# EasyEDA schematic ERA battery.json
TITLE: Sheet_1; REV: 1.0; Date: 2021-11-12; Sheet: 1/1; Company: Your Company
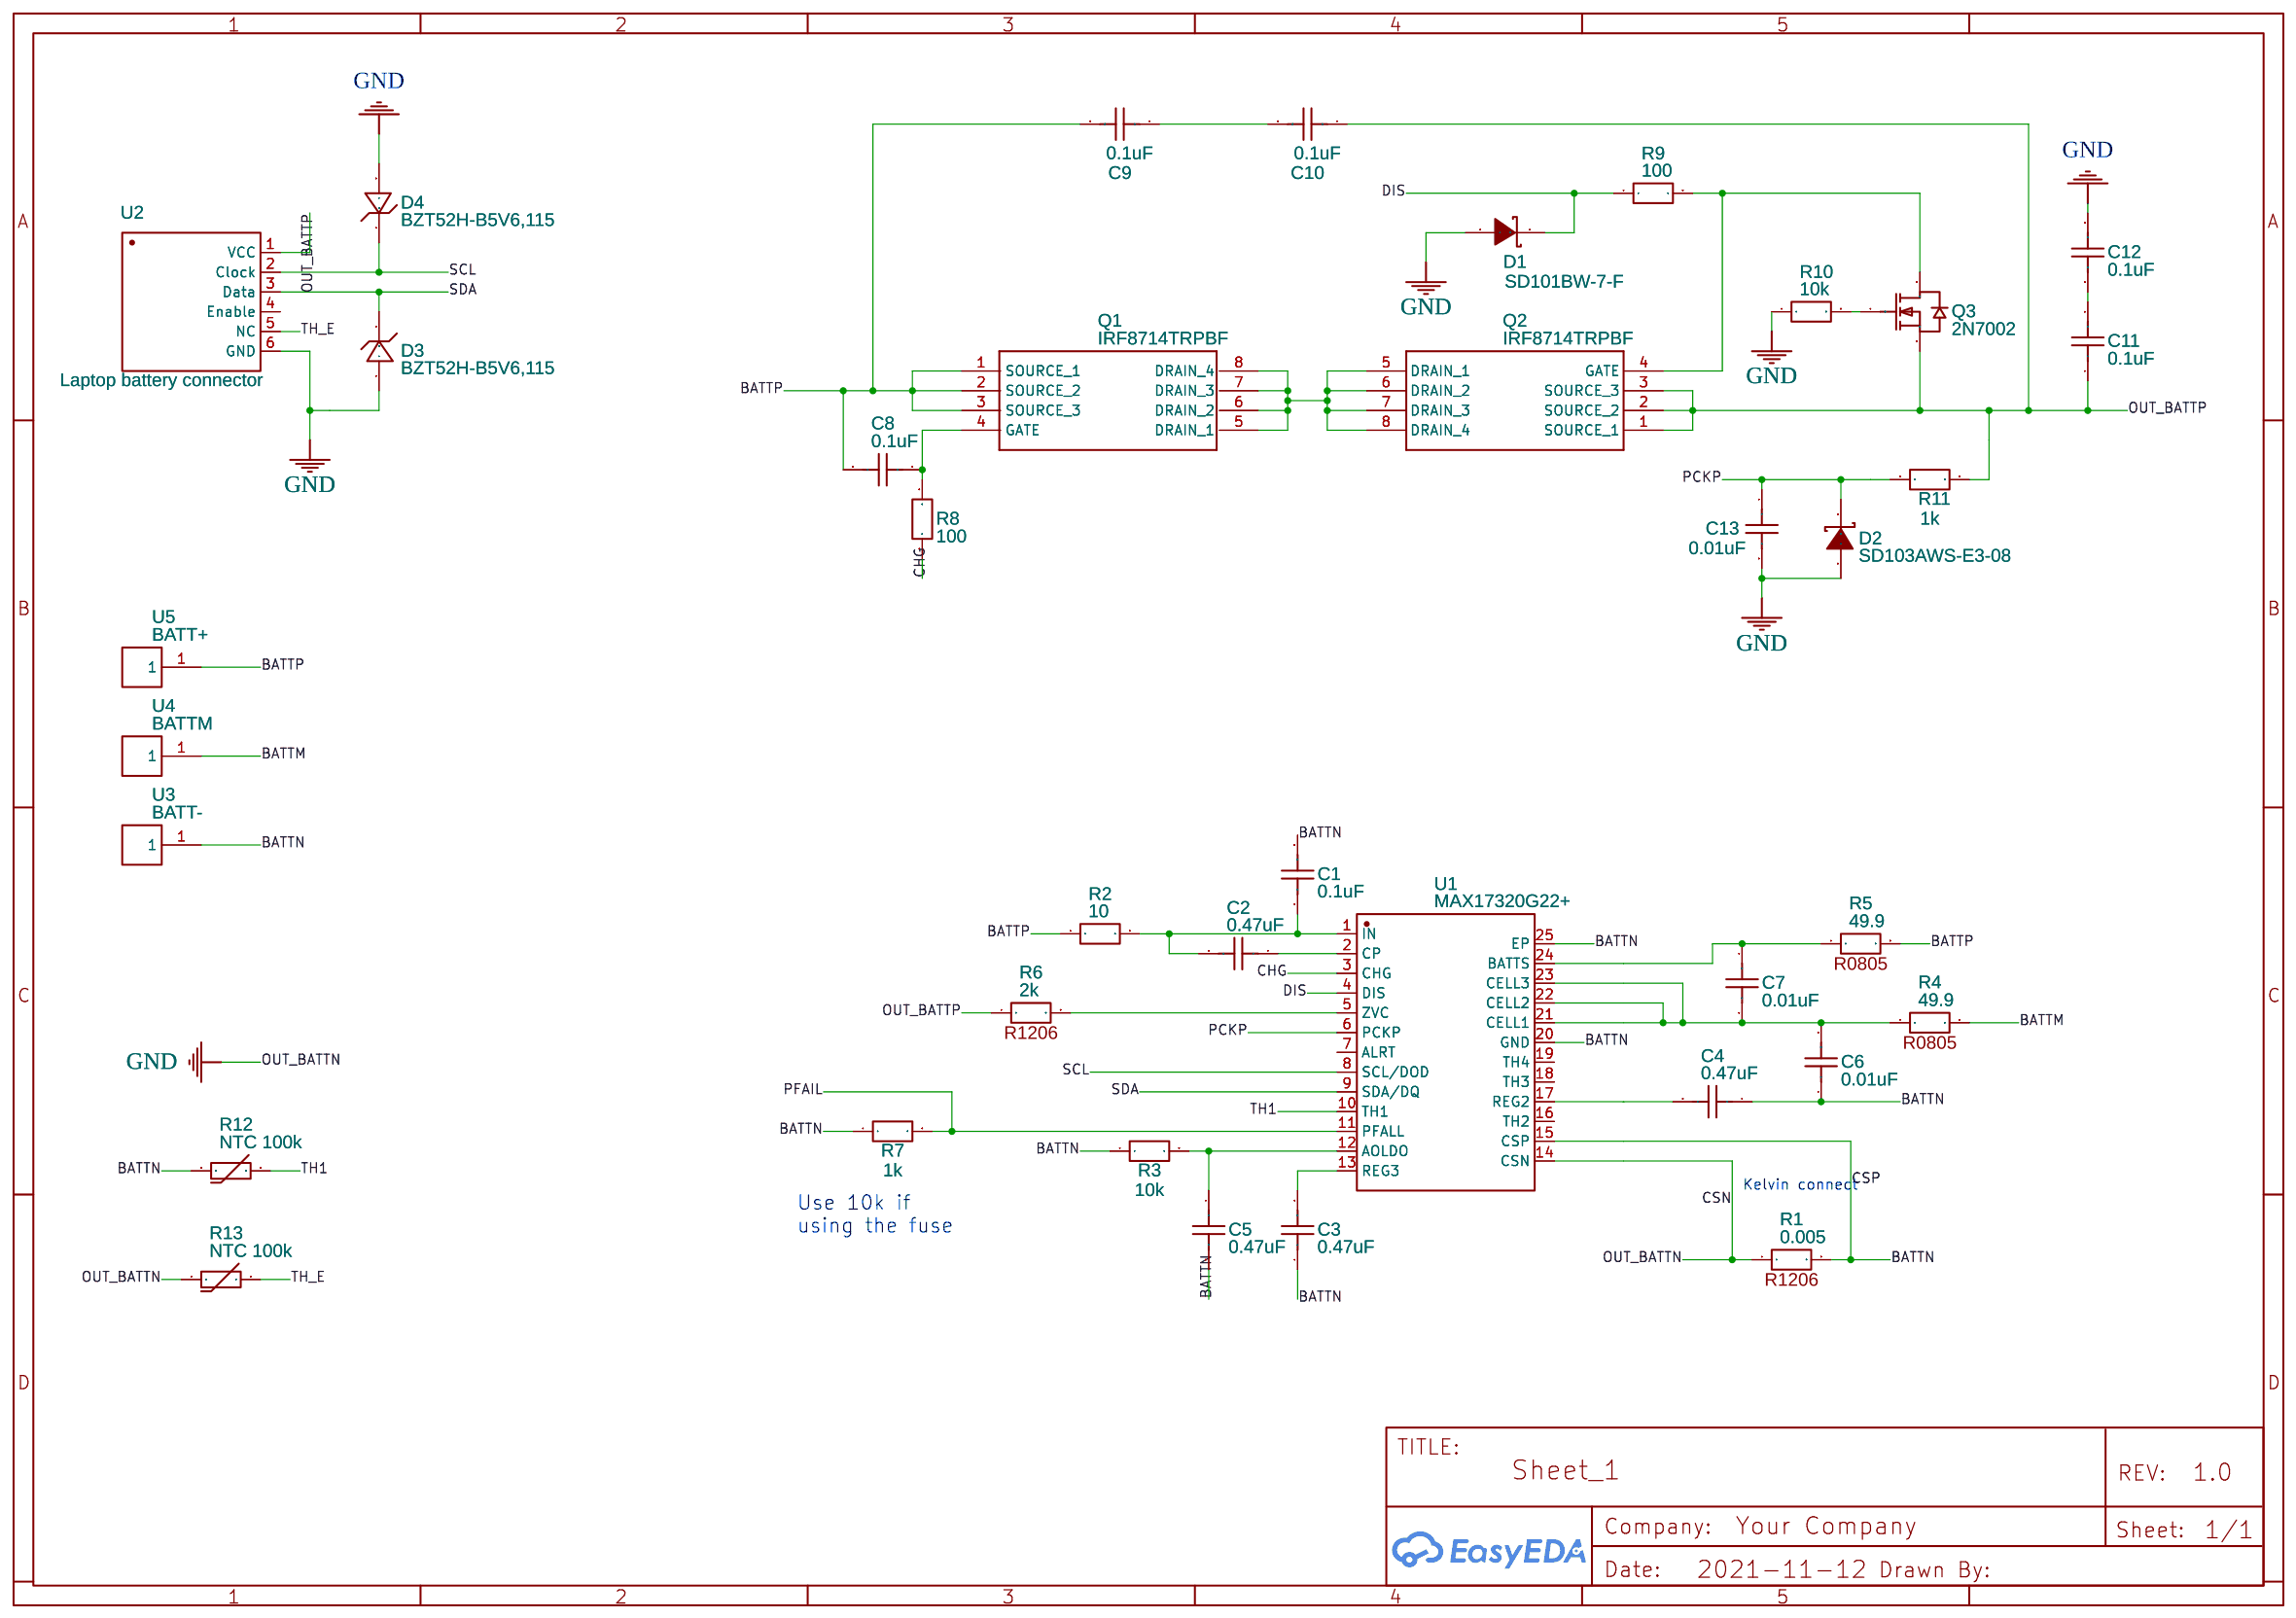
[diagram p0: schematic sheet]

## Parts
C1  0.1uF  [C0402]
C2  0.47uF  [C0402]
C3  0.47uF  [C0402]
C4  0.47uF  [C0402]
C5  0.47uF  [C0402]
C6  0.01uF  [C0402]
C7  0.01uF  [C0402]
C8  0.1uF  [C0402]
C9  0.1uF  [C0402]
C10  0.1uF  [C0402]
C11  0.1uF  [C0402]
C12  0.1uF  [C0402]
C13  0.01uF  [C0402]
D1  SD101BW-7-F  [SOD-323_L1.8-W1.3-LS2.5-RD]
D2  SD103AWS-E3-08  [SOD-323_L1.8-W1.3-LS2.5-RD]
D3  BZT52H-B5V6,115  [SOD-123F_L2.8-W1.8-LS3.7-RD]
D4  BZT52H-B5V6,115  [SOD-123F_L2.8-W1.8-LS3.7-RD]
Q1  IRF8714TRPBF  [SOIC127P600X175-8N]
Q2  IRF8714TRPBF  [SOIC127P600X175-8N]
Q3  2N7002  [SOT-23-3_L2.9-W1.3-P1.90-LS2.4-BR]
R1  0.005  [R1206]
R2  10  [R0402]
R3  10k  [R0402]
R4  49.9  [R0805]
R5  49.9  [R0805]
R6  2k  [R1206]
R7  1k  [R0402]
R8  100  [R0402]
R9  100  [R0402]
R10  10k  [R0402]
R11  1k  [R0402]
R12  NTC 100k  [R0805]
R13  NTC 100k  [R0805]
U1  MAX17320G22+  [QFN-24_L4.0-W4.0-P0.50-BL-EP2.6]
U2  Laptop battery connector  [6 PIN LAPTOP CONNECTOR]
U3  BATT-  [PAD-1X-5X5MM]
U4  BATTM  [PAD-1X-5X5MM]
U5  BATT+  [PAD-1X-5X5MM]

## Library data of the parts
C1 C8-C12 = C_0603_US: Contributor: LCEDA_Lib; Note: 25V
C2 = C_0603_US: Contributor: LCEDA_Lib; Package Display: No; Note: 25V
C3-C7 = C_0603_US: Contributor: LCEDA_Lib; Note: 10V
C13 = C_0603_US: Contributor: LCEDA_Lib; Note: 50V
D1 = SD101BWS-7-F: Supplier: LCSC; Supplier Part: C526757; Manufacturer: Diodes Incorporated; Contributor: LCSC; JLCPCB Part Class: Extended Part
D2 = SD103AWS-E3-08: Supplier: LCSC; Manufacturer: VISHAY; Contributor: LCSC; Supplier Part: C142592; JLCPCB Part Class: Extended Part
D3 D4 = BZT52H-B5V6,115: Supplier: LCSC; Supplier Part: C426804; Manufacturer: Nexperia; Contributor: LCSC; JLCPCB Part Class: Extended Part
Q1 Q2 = IRF8714TRPBF: Contributor: Jorge Ignacio Sánchez Flores
Q3 = 2N7002: Supplier: LCSC; Manufacturer: CJ; Supplier Part: C8545; JLCPCB Part Class: Basic Part
R1 = R_1206_EU: Contributor: LCEDA_Lib; Package Display: Yes
R2 R7 = R_0603_EU: Contributor: LCEDA_Lib; Package Display: No
R3 R8-R11 = R_0603_EU: Contributor: LCEDA_Lib
R4 R5 = R_0805_EU: Contributor: LCEDA_Lib; Package Display: Yes
R6 = R_1210_EU: Contributor: LCEDA_Lib; Package Display: Yes; Note: 0.25W
R12 R13 = CMFB102J3200HANT: Supplier: LCSC; Manufacturer: FH; Supplier Part: C75245; JLCPCB Part Class: Extended Part
U1 = MAX17320G22+: Supplier: LCSC; Supplier Part: C2914309; JLCPCB Part Class: Extended Part; Contributor: LCSC
U2 = Laptop battery connector: Contributor: PixelCircuit
U3-U5 = PAD1: Contributor: luisf18

## Nets
BATTM: R4.2 U4.1
BATTN: C1.2 C3.1 C4.1 C5.2 C6.1 R1.2 R3.1 R7.1 R12.1 U1.15(CSP) U1.20(GND) U1.25(EP) U3.1
BATTP: C8.2 C9.2 Q1.1(SOURCE) Q1.2(SOURCE) Q1.3(SOURCE) R2.1 R5.2 U5.1
CHG: R8.1 U1.3(CHG)
CSN: C12.2 C13.2 D1.2(A) D2.2(A) D3.2(A) D4.2(A) R1.1 R10.1 R13.1 U1.14(CSN) U2.6(GND)
DIS: D1.1(C) R9.1 U1.4(DIS)
OUT_BATTP: C10.1 C11.1 Q2.1(SOURCE) Q2.2(SOURCE) Q2.3(SOURCE) Q3.2(S) R6.1 R11.2 U2.1(VCC)
PCKP: C13.1 D2.1(K) R11.1 U1.6(PCKP)
PFAIL: R7.2 U1.11(PFALL)
SCL: D4.1(C) U1.8(SCL/DOD) U2.2(Clock)
SDA: D3.1(C) U1.9(SDA/DQ) U2.3(Data)
TH1: R12.2 U1.10(TH1)
TH_E: R13.2 U2.5(NC)
Net-(C1-1): C1.1 C2.2 R2.2 U1.1(IN)
Net-(C2-1): C2.1 U1.2(CP)
Net-(C3-2): C3.2 U1.13(REG3)
Net-(C4-2): C4.2 U1.17(REG2)
Net-(C5-1): C5.1 R3.2 U1.12(AOLDO)
Net-(C6-2): C6.2 C7.2 R4.1 U1.21(CELL1) U1.22(CELL2) U1.23(CELL3)
Net-(C7-1): C7.1 R5.1 U1.24(BATTS)
Net-(C8-1): C8.1 Q1.4(GATE) R8.2
Net-(C9-1): C9.1 C10.2
Net-(C11-2): C11.2 C12.1
Net-(Q1-5): Q1.5(DRAIN_1) Q1.6(DRAIN_2) Q1.7(DRAIN_3) Q1.8(DRAIN_4) Q2.5(DRAIN_1) Q2.6(DRAIN_2) Q2.7(DRAIN_3) Q2.8(DRAIN_4)
Net-(Q2-4): Q2.4(GATE) Q3.3(D) R9.2
Net-(Q3-1): Q3.1(G) R10.2
Net-(R6-2): R6.2 U1.5(ZVC)

Not connected (* = marked no-connect by the designer): U1 7(ALRT) 16(TH2) 18(TH3) 19(TH4); U2 4(Enable)

## Notes on the sheet
- Kelvin connect
- Use 10k if
  using the fuse
